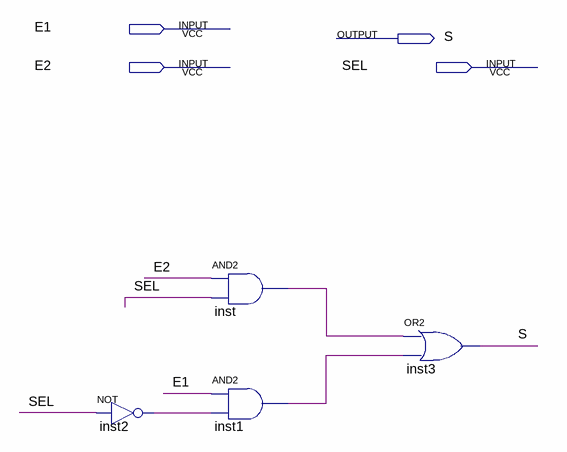
[diagram p0: schematic sheet]
// Quartus schematic MUX.bdf as structural Verilog: 4 symbols, 4 pins
module MUX (
  input  E1,
  input  E2,
  input  SEL,
  output S
);

  wire inst1_out, inst2_out, inst_out;

  not inst2 (inst2_out, SEL);
  and inst (inst_out, E2, SEL);
  and inst1 (inst1_out, E1, inst2_out);
  or inst3 (S, inst_out, inst1_out);
endmodule
